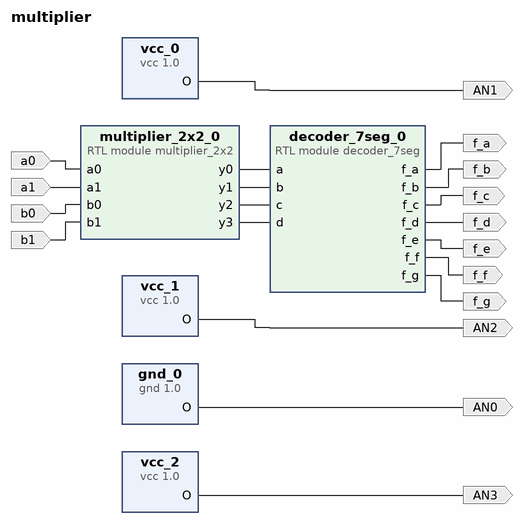
[diagram p0: block diagram of the top level]
# Vivado block design multiplier, xc7a35tcpg236-1, Vivado 2018.2.1
create_bd_design multiplier

create_bd_port -dir O AN1
create_bd_port -dir O AN2
create_bd_port -dir O AN0
create_bd_port -dir O AN3
create_bd_port -dir I a0
create_bd_port -dir I a1
create_bd_port -dir I b0
create_bd_port -dir I b1
create_bd_port -dir O f_a
create_bd_port -dir O f_b
create_bd_port -dir O f_c
create_bd_port -dir O f_d
create_bd_port -dir O f_e
create_bd_port -dir O f_f
create_bd_port -dir O f_g

create_bd_cell -type ip -vlnv FIT:user:gnd:1.0 gnd_0
create_bd_cell -type ip -vlnv FIT:user:vcc:1.0 vcc_0
create_bd_cell -type ip -vlnv FIT:user:vcc:1.0 vcc_1
create_bd_cell -type ip -vlnv FIT:user:vcc:1.0 vcc_2
create_bd_cell -type module -reference decoder_7seg decoder_7seg_0
create_bd_cell -type module -reference multiplier_2x2 multiplier_2x2_0

# ---- connections ----

connect_bd_net [get_bd_pins vcc_0/O] [get_bd_ports AN1]
connect_bd_net [get_bd_pins vcc_1/O] [get_bd_ports AN2]
connect_bd_net [get_bd_pins gnd_0/O] [get_bd_ports AN0]
connect_bd_net [get_bd_pins vcc_2/O] [get_bd_ports AN3]
connect_bd_net -net a0_0_1 [get_bd_ports a0] [get_bd_pins multiplier_2x2_0/a0]
connect_bd_net -net a1_0_1 [get_bd_ports a1] [get_bd_pins multiplier_2x2_0/a1]
connect_bd_net -net b0_0_1 [get_bd_ports b0] [get_bd_pins multiplier_2x2_0/b0]
connect_bd_net -net b1_0_1 [get_bd_ports b1] [get_bd_pins multiplier_2x2_0/b1]
connect_bd_net [get_bd_pins decoder_7seg_0/f_a] [get_bd_ports f_a]
connect_bd_net [get_bd_pins decoder_7seg_0/f_b] [get_bd_ports f_b]
connect_bd_net [get_bd_pins decoder_7seg_0/f_c] [get_bd_ports f_c]
connect_bd_net [get_bd_pins decoder_7seg_0/f_d] [get_bd_ports f_d]
connect_bd_net [get_bd_pins decoder_7seg_0/f_e] [get_bd_ports f_e]
connect_bd_net [get_bd_pins decoder_7seg_0/f_f] [get_bd_ports f_f]
connect_bd_net [get_bd_pins decoder_7seg_0/f_g] [get_bd_ports f_g]
connect_bd_net [get_bd_pins multiplier_2x2_0/y0] [get_bd_pins decoder_7seg_0/a]
connect_bd_net [get_bd_pins multiplier_2x2_0/y1] [get_bd_pins decoder_7seg_0/b]
connect_bd_net [get_bd_pins multiplier_2x2_0/y2] [get_bd_pins decoder_7seg_0/c]
connect_bd_net [get_bd_pins multiplier_2x2_0/y3] [get_bd_pins decoder_7seg_0/d]

validate_bd_design
save_bd_design
